# Altium schematic sheet mux.SchDoc
size A4; SheetNumber: 3; SheetTotal: 3
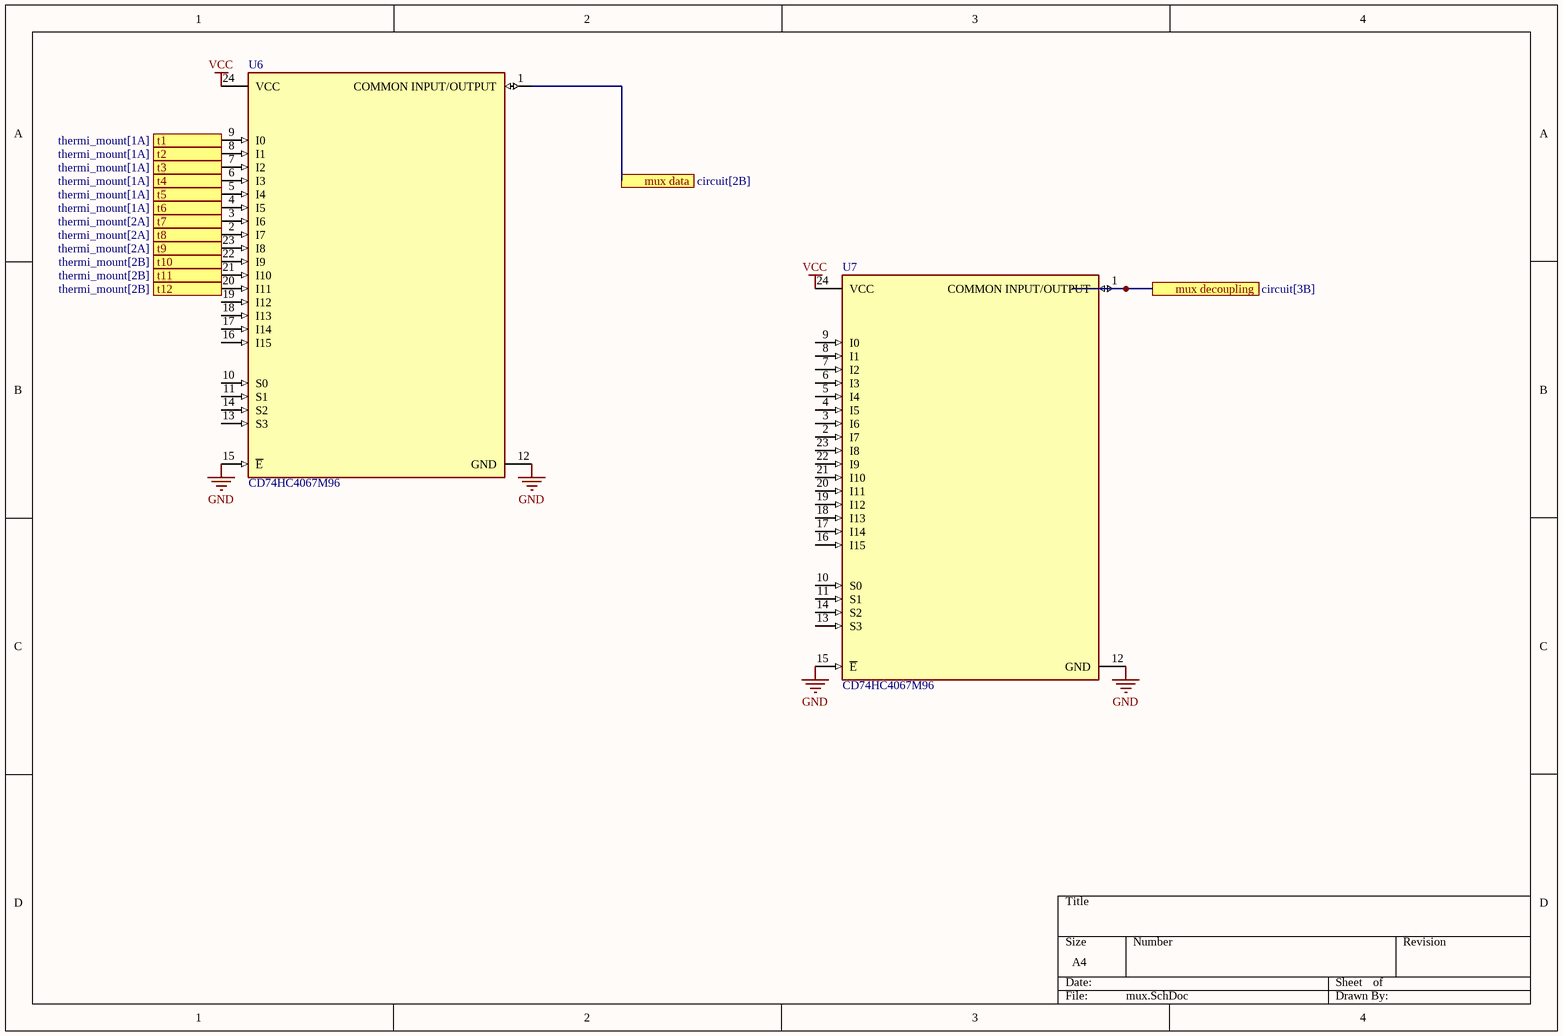
[diagram p0: mux.SchDoc]

## Parts
U6  CD74HC4067M96  [FP-DW0024A-MFG]
U7  CD74HC4067M96  [FP-DW0024A-MFG]

## Ports
mux data (see circuit[2B]), mux decoupling (see circuit[3B]), t1 (see thermi_mount[1A]), t2 (see thermi_mount[1A]), t3 (see thermi_mount[1A]), t4 (see thermi_mount[1A]), t5 (see thermi_mount[1A]), t6 (see thermi_mount[1A]), t7 (see thermi_mount[2A]), t8 (see thermi_mount[2A]), t9 (see thermi_mount[2A]), t10 (see thermi_mount[2B]), t11 (see thermi_mount[2B]), t12 (see thermi_mount[2B])

## Nets
GND: U6.12(GND) U6.15(~{E}) U7.12(GND) U7.15(~{E})
VCC: U6.24(VCC) U7.24(VCC)
mux data: U6.1(COMMON_INPUT/OUTPUT) ; port mux data
mux decoupling: U7.1(COMMON_INPUT/OUTPUT) ; port mux decoupling
t1: U6.9(I0) ; port t1
t2: U6.8(I1) ; port t2
t3: U6.7(I2) ; port t3
t4: U6.6(I3) ; port t4
t5: U6.5(I4) ; port t5
t6: U6.4(I5) ; port t6
t7: U6.3(I6) ; port t7
t8: U6.2(I7) ; port t8
t9: U6.23(I8) ; port t9
t10: U6.22(I9) ; port t10
t11: U6.21(I10) ; port t11
t12: U6.20(I11) ; port t12

Not connected (* = marked no-connect by the designer): U6 10(S0) 11(S1) 13(S3) 14(S2) 16(I15) 17(I14) 18(I13) 19(I12); U7 2(I7) 3(I6) 4(I5) 5(I4) 6(I3) 7(I2) 8(I1) 9(I0) 10(S0) 11(S1) 13(S3) 14(S2) 16(I15) 17(I14) 18(I13) 19(I12) 20(I11) 21(I10) 22(I9) 23(I8)

## Library data of the parts
U6 U7 = CMP-04901-000007-1: IC MUX/DEMUX 1X16 24SOIC; Manufacturer: Texas Instruments; Standoff Height: 0.1mm; Logic Function Desc: Non-Inverting; Max Supply Voltage: 6V; Number Of Inputs: 16; Quiescent Current: 8uA; Number Of Circuits: 1; Propagation Delay: 6ns; Max Junction Temp: +150°C; Min Supply Voltage: 2V; ComponentLink2Description: Datasheet; Octopart: https://octopart.com/cd74hc4067m96-texas+instruments-722802; Ambient Temperature Range High: +125°C; Ipc Land Pattern Name: SOIC127P1030X265-24; Height: 2.65mm; Mouser Description: Multiplexer Switch ICs Hi-Spd CMOS 16Ch Anl Mltplxr/Demltplxr; Temperature Range Low: -55°C; Package: DW0024A; Temperature Range High: +125°C; Lead Free: Yes; ComponentLink2URL: http://www.ti.com/lit/ds/symlink/cd74hc4067.pdf; Manufacturer Part Number: CD74HC4067M96; RoHS: TRUE; Automotive: No; Device Class L1: Integrated Circuits (ICs); Digikey Description: IC MUX/DEMUX 1X16 24SOIC; Device Class L2: Logic ICs; Temperature: -55°C to +125°C; Device Class L3: Multiplexers; Category: IC; Ambient Temperature Range Low: -55°C; Number Of Outputs: 1